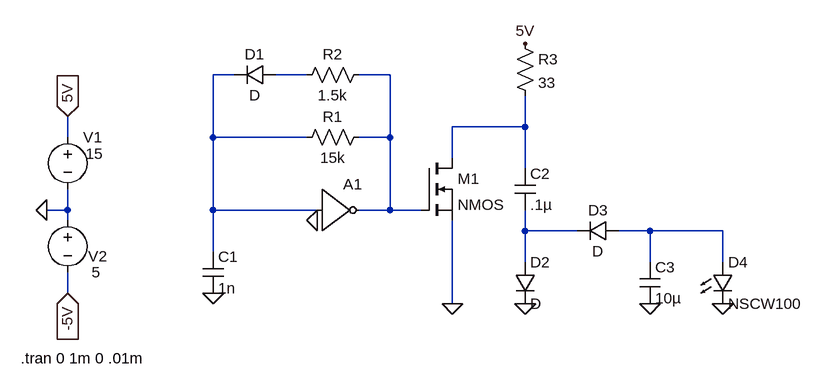
[diagram p0: schematic Phase shift oscillator.asc]
Phase shift oscillator.asc, the LTspice schematic file:
Version 4
SHEET 1 2604 1992
WIRE 112 -64 80 -64
WIRE 224 -64 176 -64
WIRE 352 -64 304 -64
WIRE 560 16 560 -32
WIRE 560 16 448 16
WIRE -144 32 -144 0
WIRE 80 32 80 -64
WIRE 224 32 80 32
WIRE 352 32 352 -64
WIRE 352 32 304 32
WIRE 448 64 448 16
WIRE 560 80 560 16
WIRE -144 144 -144 112
WIRE -144 144 -176 144
WIRE 80 144 80 32
WIRE 240 144 80 144
WIRE 352 144 352 32
WIRE 352 144 304 144
WIRE 400 144 352 144
WIRE -144 160 -144 144
WIRE 560 176 560 144
WIRE 640 176 560 176
WIRE 752 176 704 176
WIRE 864 176 752 176
WIRE 80 208 80 144
WIRE 560 224 560 176
WIRE 752 224 752 176
WIRE 864 224 864 176
WIRE -144 272 -144 240
WIRE 448 288 448 160
FLAG -144 272 -5V
IOPIN -144 272 In
FLAG -176 144 0
FLAG -144 0 5V
IOPIN -144 0 In
FLAG 240 160 0
FLAG 80 272 0
FLAG 560 288 0
FLAG 752 288 0
FLAG 864 288 0
FLAG 448 288 0
FLAG 560 -112 5V
SYMBOL voltage -144 16 R0
WINDOW 3 28 41 Left 2
WINDOW 123 0 0 Left 2
WINDOW 39 0 0 Left 2
SYMATTR Value 15
SYMATTR InstName V1
SYMBOL voltage -144 144 R0
WINDOW 0 32 71 Left 2
WINDOW 3 37 96 Left 2
WINDOW 123 0 0 Left 2
WINDOW 39 0 0 Left 2
SYMATTR InstName V2
SYMATTR Value 5
SYMBOL nmos 400 64 R0
SYMATTR InstName M1
SYMBOL Digital\\inv 240 80 R0
SYMATTR InstName A1
SYMATTR SpiceLine Vhigh=15V,Td=1m,Trise=1m
SYMBOL res 320 16 R90
WINDOW 0 0 56 VBottom 2
WINDOW 3 32 56 VTop 2
SYMATTR InstName R1
SYMATTR Value 15k
SYMBOL res 320 -80 R90
WINDOW 0 0 56 VBottom 2
WINDOW 3 32 56 VTop 2
SYMATTR InstName R2
SYMATTR Value 1.5k
SYMBOL diode 176 -80 R90
WINDOW 0 0 32 VBottom 2
WINDOW 3 32 32 VTop 2
SYMATTR InstName D1
SYMBOL cap 64 208 R0
SYMATTR InstName C1
SYMATTR Value 1n
SYMBOL res 544 -128 R0
SYMATTR InstName R3
SYMATTR Value 33
SYMBOL cap 544 80 R0
SYMATTR InstName C2
SYMATTR Value .1µ
SYMBOL diode 544 224 R0
SYMATTR InstName D2
SYMBOL diode 704 160 R90
WINDOW 0 0 32 VBottom 2
WINDOW 3 32 32 VTop 2
SYMATTR InstName D3
SYMBOL cap 736 224 R0
SYMATTR InstName C3
SYMATTR Value 10µ
SYMBOL LED 848 224 R0
SYMATTR InstName D4
SYMATTR Value NSCW100
SYMATTR Description Zener Diode
SYMATTR Type zener
TEXT -216 372 Left 2 !.tran 0 1m 0 .01m

The netlist it stands for:
* Phase shift oscillator.asc
V1 5V 0 15
V2 0 -5V 5
M1 N004 N003 0 0 NMOS
A1 N001 0 0 0 0 N003 0 0 BUF Vhigh=15V,Td=1m,Trise=1m
R1 N003 N001 15k
R2 N003 N002 1.5k
D1 N002 N001 D
C1 N001 0 1n
R3 5V N004 33
C2 N004 N005 .1µ
D2 N005 0 D
D3 N006 N005 D
C3 N006 0 10µ
D4 N006 0 NSCW100
.model D D
.lib standard.dio
.model NMOS NMOS
.model PMOS PMOS
.lib standard.mos
.tran 0 1m 0 .01m
.backanno
.end